# EAGLE design grbl_nano_my_clone_PR3 (EAGLE 8.1.1)
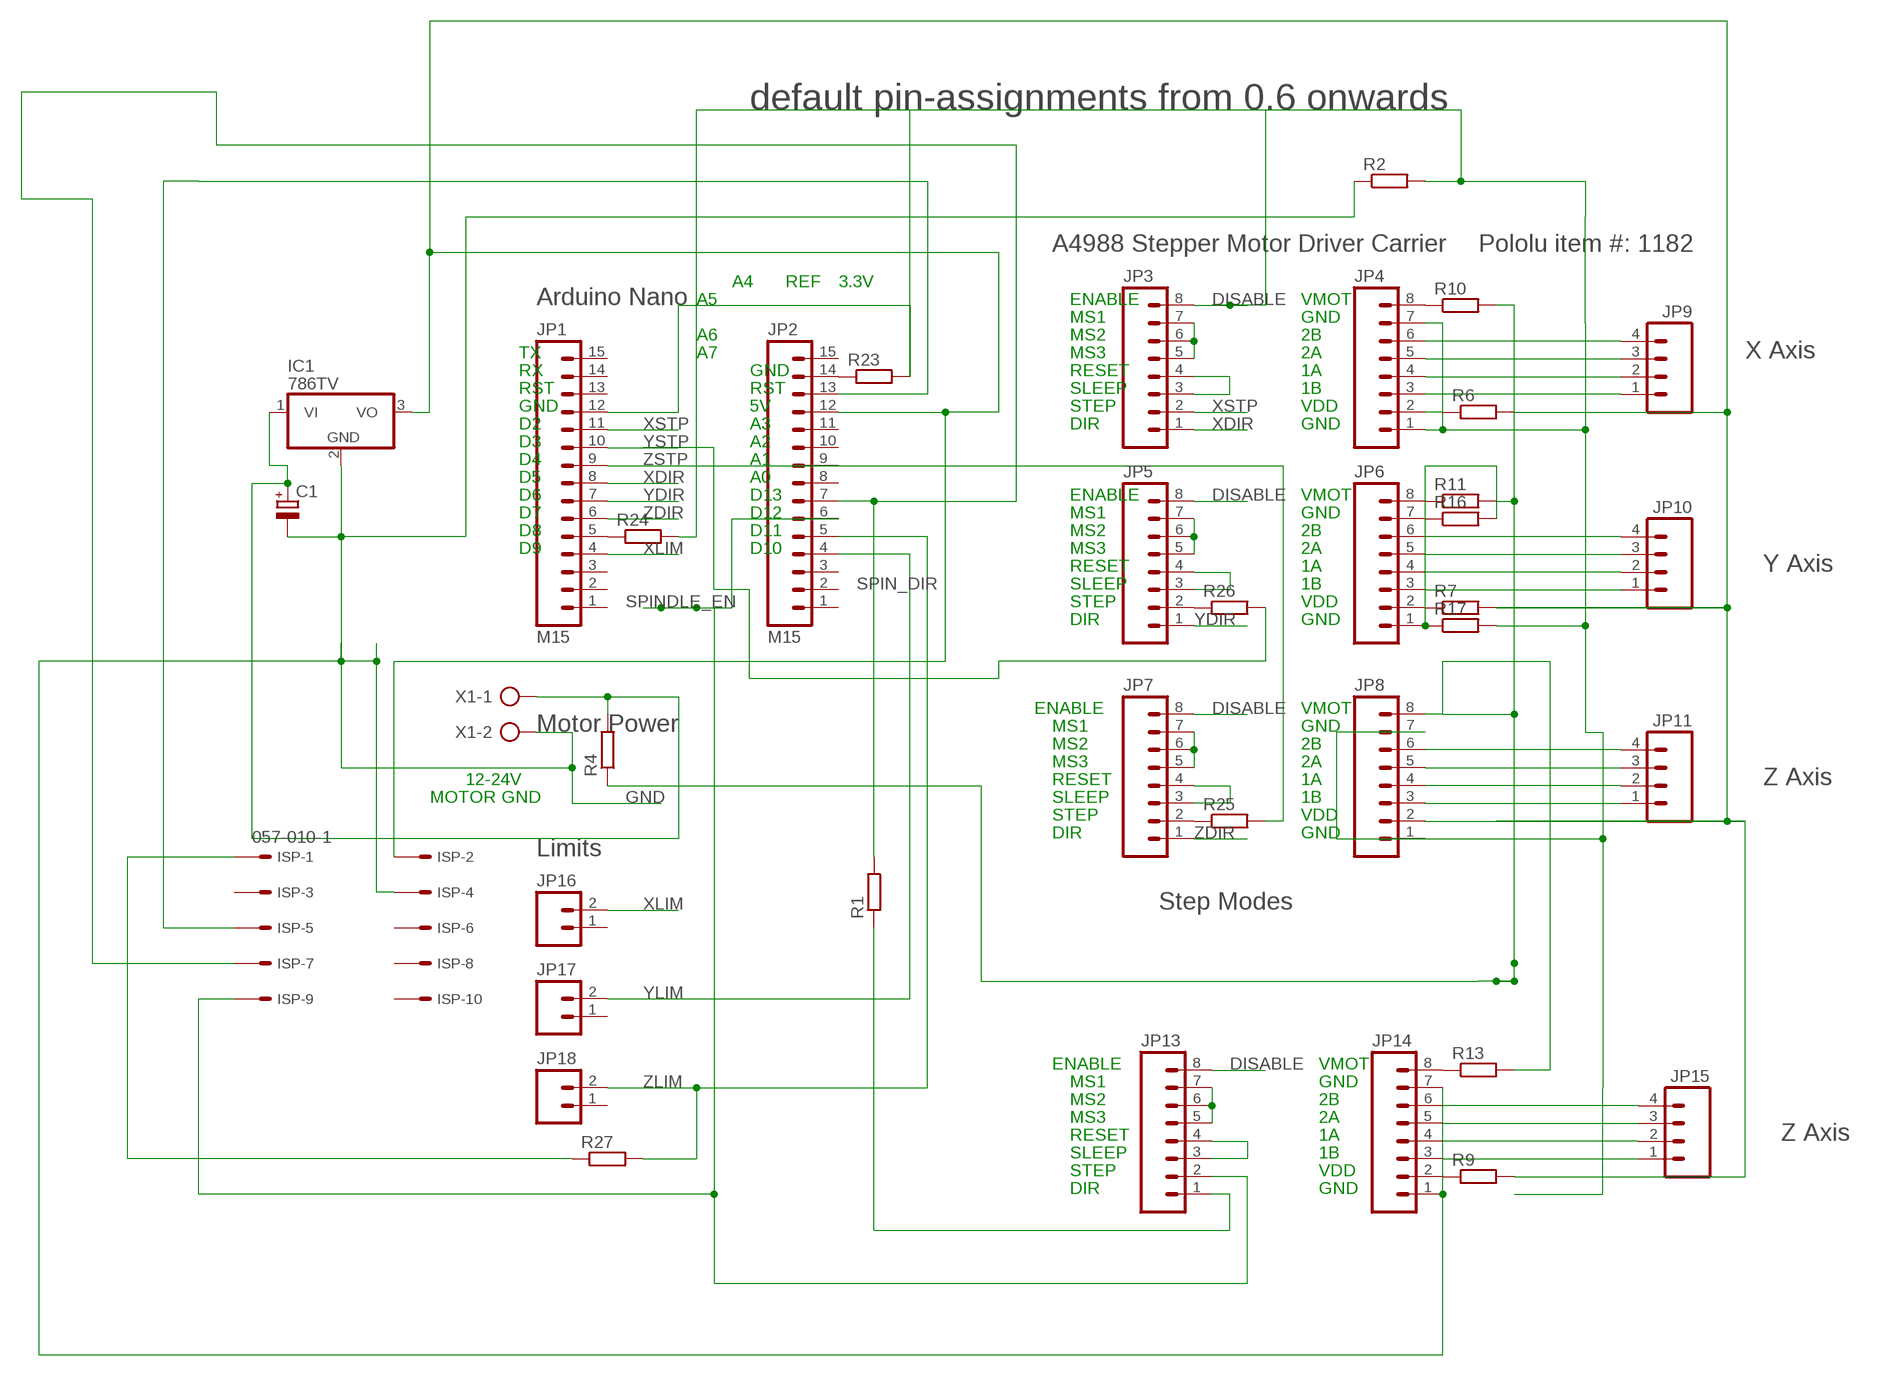
[diagram p0: schematic, sheet 1]

## Parts
C1  CPOL-EUE3.5-8  [E3,5-8]
IC1  786TV  [TO220V]
ISP  057-010-1  [057-010-1]
JP1  M15  [1X15]
JP2  M15  [1X15]
JP3  M08LONGPADS  [1X08_LONGPADS]
JP4  M08LONGPADS  [1X08_LONGPADS]
JP5  M08LONGPADS  [1X08_LONGPADS]
JP6  M08LONGPADS  [1X08_LONGPADS]
JP7  M08LONGPADS  [1X08_LONGPADS]
JP8  M08LONGPADS  [1X08_LONGPADS]
JP9  M04LONGPADS  [1X04_LONGPADS]
JP10  M04LONGPADS  [1X04_LONGPADS]
JP11  M04LONGPADS  [1X04_LONGPADS]
JP13  M08LONGPADS  [1X08_LONGPADS]
JP14  M08LONGPADS  [1X08_LONGPADS]
JP15  M04LONGPADS  [1X04_LONGPADS]
JP16  M02LOCK_LONGPADS  [1X02_LOCK_LONGPADS]
JP17  M02LOCK_LONGPADS  [1X02_LOCK_LONGPADS]
JP18  M02LOCK_LONGPADS  [1X02_LOCK_LONGPADS]
R1  R-EU_0207/15  [0207/15]
R2  R-EU_0207/15  [0207/15]
R4  R-EU_0207/12  [0207/12]
R6  R-EU_0207/15  [0207/15]
R7  R-EU_0207/15  [0207/15]
R9  R-EU_0207/15  [0207/15]
R10  R-EU_0207/7  [0207/7]
R11  R-EU_0207/7  [0207/7]
R13  R-EU_0207/15  [0207/15]
R16  R-EU_0207/12  [0207/12]
R17  R-EU_0207/12  [0207/12]
R23  R-EU_0207/15  [0207/15]
R24  R-EU_0207/15  [0207/15]
R25  R-EU_0207/15  [0207/15]
R26  R-EU_0207/15  [0207/15]
R27  R-EU_0207/15  [0207/15]
X1  AK300/2  [AK300/2]

## Nets
5V: IC1.3(VO) ISP.2 JP2.12 JP8.2 R6.2 R7.2 R9.2
DISABLE: JP3.8 JP5.8 JP7.8 JP13.8 R24.2
GND: C1.- IC1.2(GND) ISP.4 JP14.1 JP14.7 R2.1 X1.2
GNDINT: JP1.12 JP4.1 JP4.7 JP8.1 JP8.7 R2.2 R17.2 R23.2
N$1: JP5.3 JP5.4
N$2: JP4.6 JP9.4
N$3: JP4.5 JP9.3
N$4: JP4.4 JP9.2
N$5: JP4.3 JP9.1
N$6: JP8.6 JP11.4
N$7: JP8.5 JP11.3
N$8: JP8.4 JP11.2
N$9: JP8.3 JP11.1
N$10: JP6.6 JP10.4
N$11: JP6.5 JP10.3
N$12: JP6.4 JP10.2
N$13: JP6.3 JP10.1
N$14: JP7.3 JP7.4
N$15: JP3.3 JP3.4
N$16: JP14.6 JP15.4
N$17: JP14.5 JP15.3
N$18: JP14.4 JP15.2
N$19: JP14.3 JP15.1
N$20: JP13.3 JP13.4
N$21: JP13.1 R1.1
N$22: ISP.5 JP2.13
N$25: JP4.2 R6.1
N$26: C1.+ IC1.1(VI) R4.2 X1.1
N$28: JP4.8 R10.1
N$29: JP3.5 JP3.6 JP3.7
N$30: JP5.2 R26.1
N$32: JP14.2 R9.1
N$33: JP6.8 R11.1
N$35: JP14.8 R13.1
N$38: JP6.7 R16.1
N$39: JP6.1 R16.2 R17.1
N$44: JP2.14 R23.1
N$45: JP1.5 R24.1
N$46: JP7.2 R25.1
N$47: JP6.2 R7.1
N$48: JP5.5 JP5.6 JP5.7
N$49: ISP.1 R27.1
N$50: JP7.5 JP7.6 JP7.7
N$51: JP13.5 JP13.6 JP13.7
SPIN_DIR: ISP.7 JP2.7 R1.2
SPINDLE_EN: ISP.9 JP2.6 JP13.2
VMOT: JP8.8 R4.1 R10.2 R11.2 R13.2
XDIR: JP1.8 JP3.1
XLIM: JP1.4 JP16.2
XSTP: JP1.11 JP3.2
YDIR: JP1.7 JP5.1
YLIM: JP2.4 JP17.2
YSTP: JP1.10 R26.2
ZDIR: JP1.6 JP7.1
ZLIM: JP2.5 JP18.2 R27.2
ZSTP: JP1.9 R25.2
Unconnected: ISP.3 ISP.6 ISP.8 ISP.10 JP1.1 JP1.2 JP1.3 JP1.13 JP1.14 JP1.15 JP2.1 JP2.2 JP2.3 JP2.8 JP2.9 JP2.10 JP2.11 JP2.15 JP16.1 JP17.1 JP18.1

## Notes on the sheet
- default pin-assignments from 0.6 onwards
- A4988 Stepper Motor Driver Carrier | Pololu item #: 1182
- A4 | REF | 3.3V
- Arduino Nano | A5 | ENABLE | VMOT
- MS1 | GND
- A6 | MS2 | 2B
- TX | A7 | MS3 | 2A | X Axis
- RX | GND | RESET | 1A
- RST | RST | SLEEP | 1B
- GND | 5V | STEP | VDD
- D2 | A3 | DIR | GND
- D3 | A2
- D4 | A1
- D5 | A0
- D6 | D13 | ENABLE | VMOT
- D7 | D12 | MS1 | GND
- D8 | D11 | MS2 | 2B
- D9 | D10 | MS3 | 2A
- RESET | 1A | Y Axis
- SLEEP | 1B
- STEP | VDD
- DIR | GND
- ENABLE | VMOT
- Motor Power | MS1 | GND
- MS2 | 2B
- MS3 | 2A
- 12-24V | RESET | 1A | Z Axis
- MOTOR GND | SLEEP | 1B
- STEP | VDD
- DIR | GND
- Limits
- Step Modes
- ENABLE | VMOT
- MS1 | GND
- MS2 | 2B
- MS3 | 2A
- RESET | 1A | Z Axis
- SLEEP | 1B
- STEP | VDD
- DIR | GND

## Library data of the parts
C1 = rcl:CPOL-EU: POLARIZED CAPACITOR, European symbol
IC1 = linear:78*: Positive VOLTAGE REGULATOR Source: http://cache.national.com/ds/LM/LM78L05.pdf http://www.fairchildsemi.com/ds/LM/LM7805.pdf
ISP = con-panduit:057-010-: CONNECTOR 10-pin series 057 contact pc board low profile headers; OC_FARNELL: unknown; OC_NEWARK: unknown
JP1 JP2 = SparkFun:M15: Header 15 Standard 15-pin 0.1" header. Use with straight break away headers (SKU : PRT-00116), right angle break away headers (PRT-00553), swiss pins (PRT-00743), machine pins (PRT-00117), and female headers (PRT-00115).
JP3-JP8 JP13 JP14 = SparkFun:M08: Header 8 Standard 8-pin 0.1" header. Use with straight break away headers (SKU : PRT-00116), right angle break away headers (PRT-00553), swiss pins (PRT-00743), machine pins (PRT-00117), and female headers (PRT-00115).
JP9-JP11 JP15 = SparkFun:M04: Header 4 Standard 4-pin 0.1" header. Use with straight break away headers (SKU : PRT-00116), right angle break away headers (PRT-00553), swiss pins (PRT-00743), machine pins (PRT-00117), and female headers (PRT-00115). Molex polarized connector foot print use with SKU : PRT-08231 with associated crimp pins and housings. 1MM SMD Version SKU: PRT-10208
JP16-JP18 = SparkFun:M02: Header 2 Standard 2-pin 0.1" header. Use with straight break away headers (SKU : PRT-00116), right angle break away headers (PRT-00553), swiss pins (PRT-00743), machine pins (PRT-00117), and female headers (PRT-00115). Molex polarized connector foot print use with SKU : PRT-08233 with associated crimp pins and housings.
R1 R2 R4 R6 R7 R9-R11 R13 R16 R17 R23-R27 = rcl:R-EU_: RESISTOR, European symbol
X1 = con-ptr500:AK300/2: CONNECTOR; OC_FARNELL: unknown; OC_NEWARK: unknown

## Board
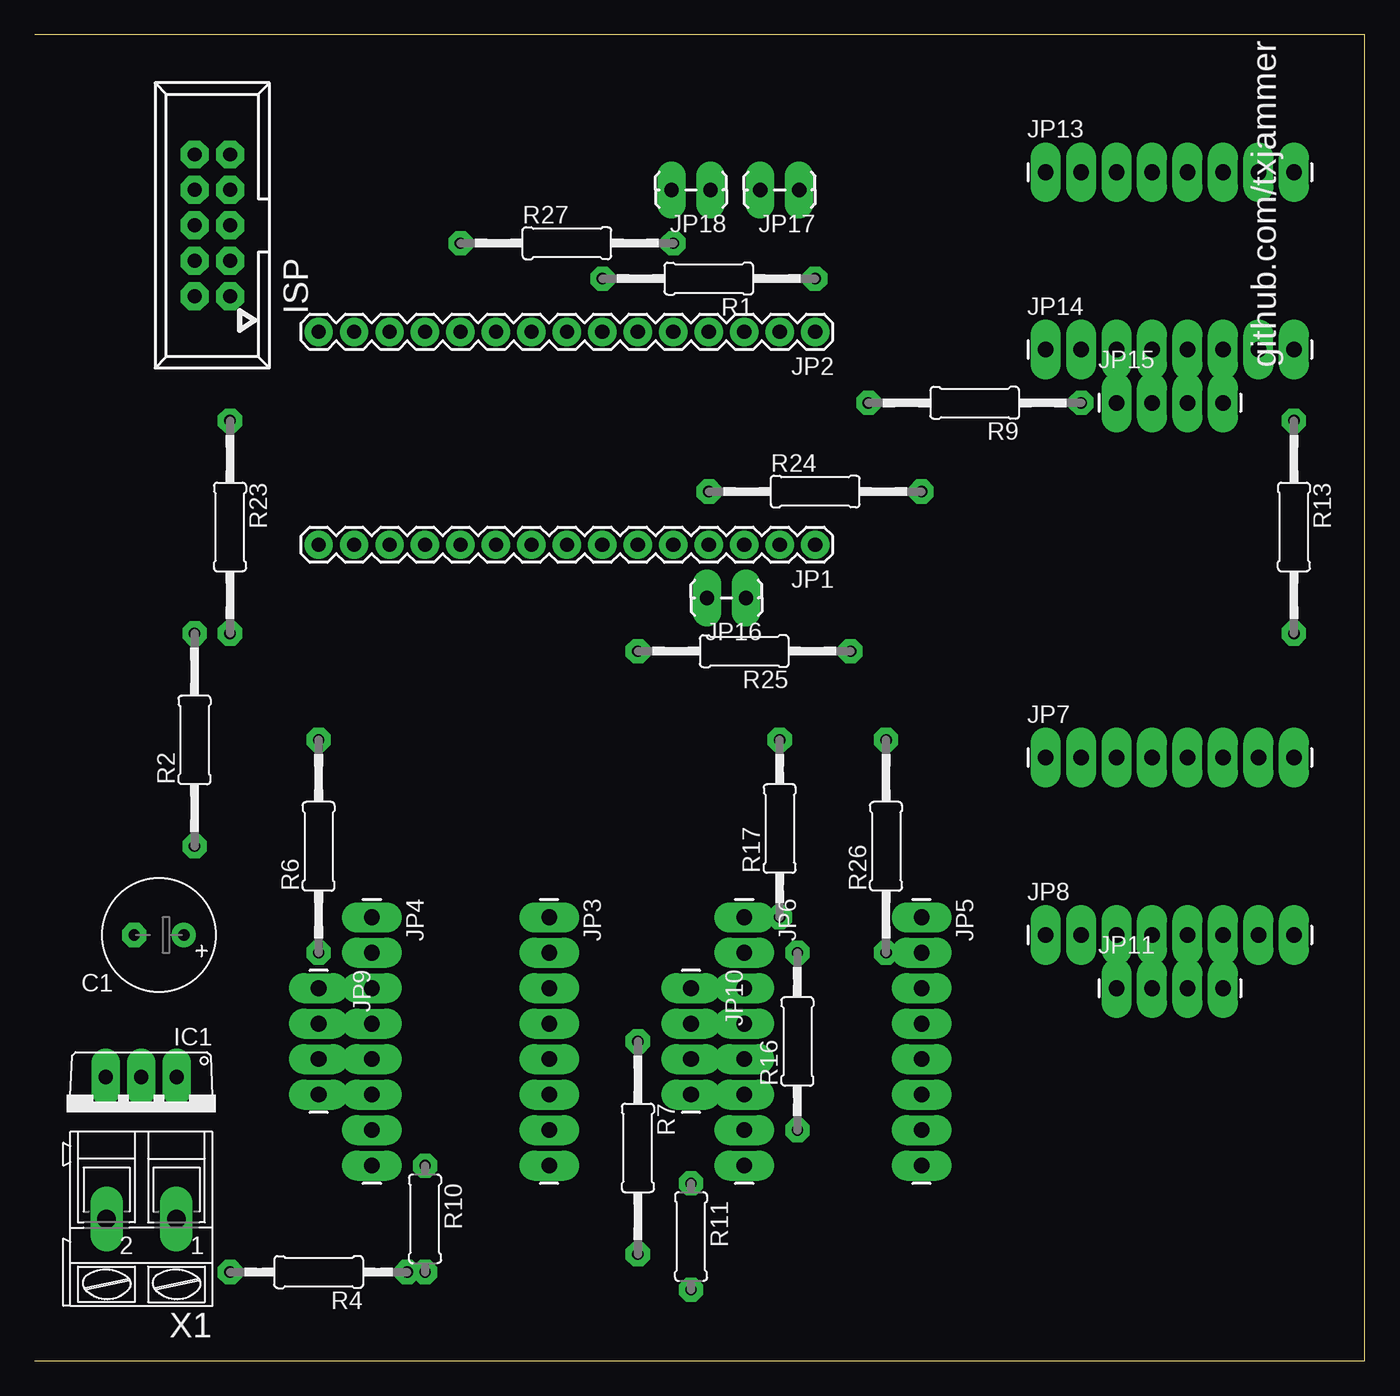
[diagram p1: board, top side]
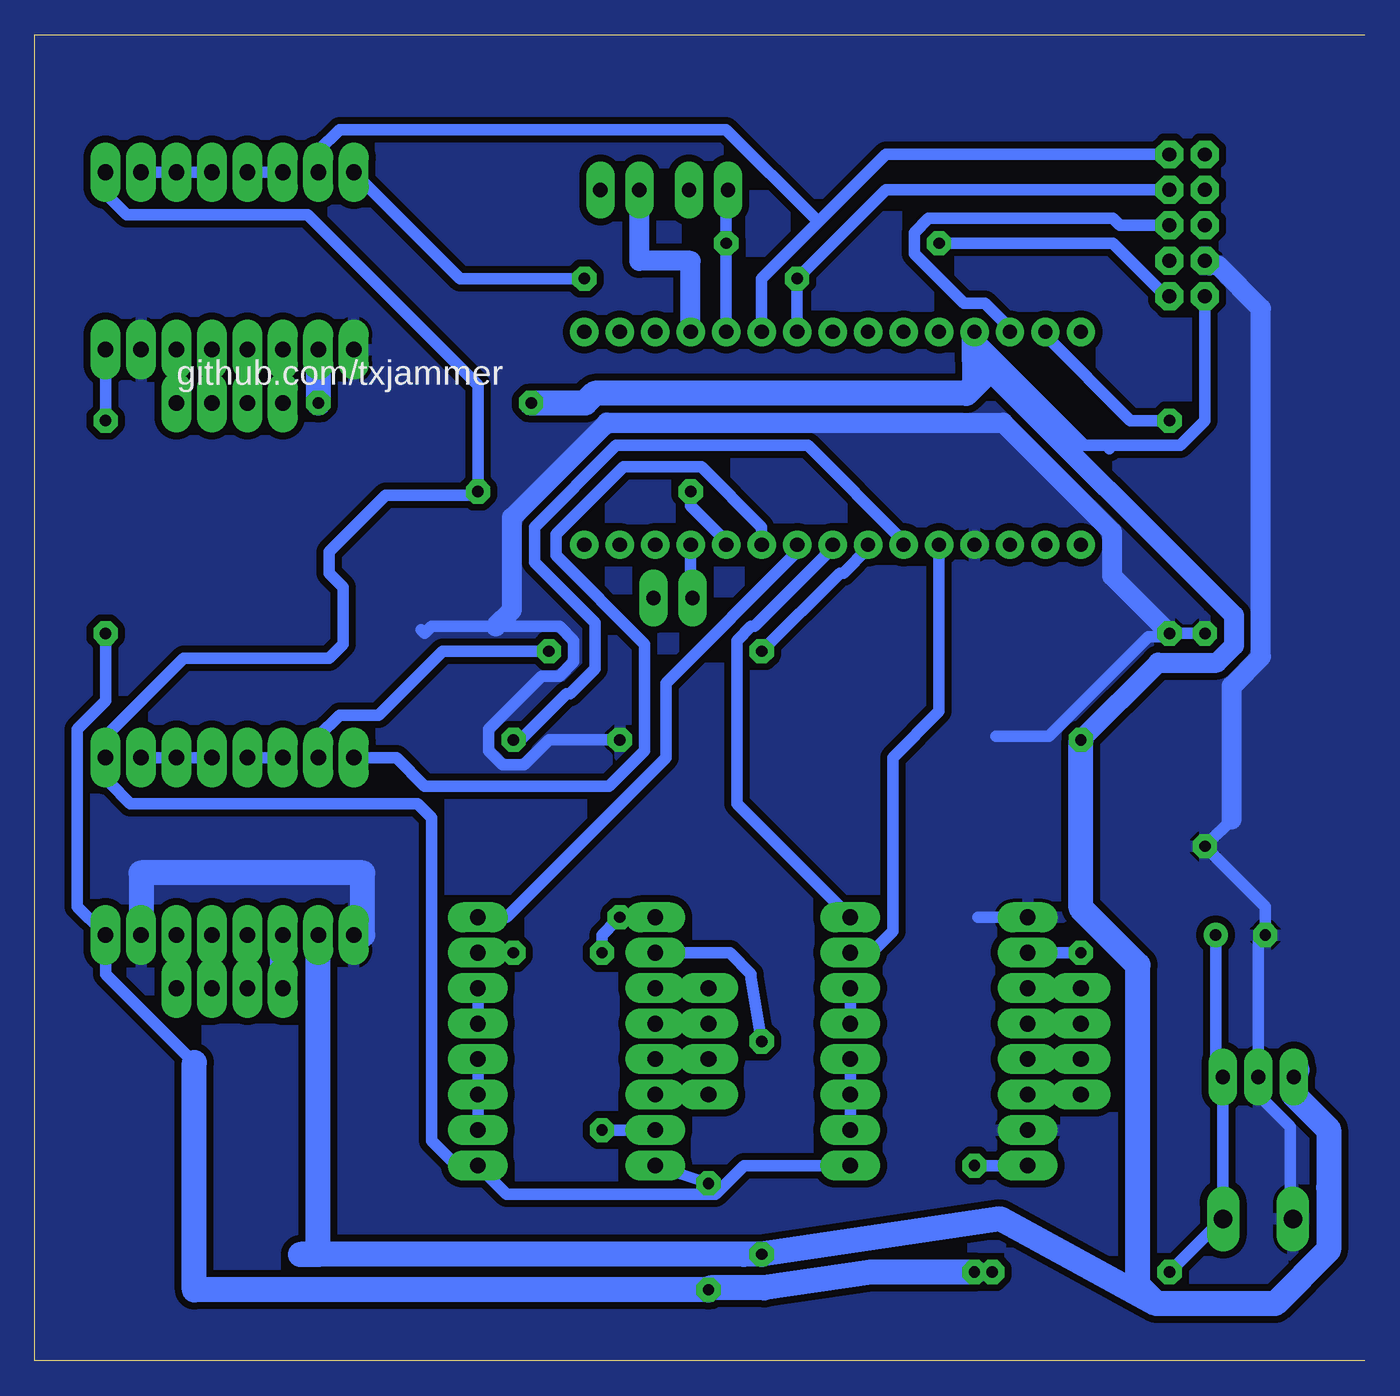
[diagram p2: board, bottom side, seen from below]

Size 95.23 x 94.92 mm. Coordinates in mm from the lower left corner, seen from the top.
Outline: 0,0 95.23,0 95.23,94.92 0,94.92
Copper layers (1*16): Top 0.035mm / dielectric 1.5mm / Bottom 0.035mm
Design rules "default *": minimum track width 32mil, minimum drill 28mil, track to track 20mil, track to pad 20mil, pad to pad 10mil, via to via 10mil, smd to smd 10mil, copper to edge 0mil, drill to drill 8mil, minimum pad ring 18mil, minimum via ring 8mil, stop-mask expansion 4mil, vias tented up to drill 0mil, thermal gap 10mil

### Footprints (pad centres in the part's own frame; a part is rotated, then mirrored left to right if it is on the bottom)
E3,5-8 = drill 0.813 pad 1.6: + -1.778,0 | drill 0.813 pad 1.6 octagon: - 1.778,0
TO220V = drill 1.016 long: 1 -2.54,-2.54; 2 0,-2.54; 3 2.54,-2.54
057-010-1 = drill 1 octagon: 1 -5.08,-1.27; 2 -5.08,1.27; 3 -2.54,-1.27; 4 -2.54,1.27; 5 0,-1.27; 6 0,1.27; 7 2.54,-1.27; 8 2.54,1.27; 9 5.08,-1.27; 10 5.08,1.27
1X15 = drill 1.016 pad 1.88: 1 0,0; 2 2.54,0; 3 5.08,0; 4 7.62,0; 5 10.16,0; 6 12.7,0; 7 15.24,0; 8 17.78,0; 9 20.32,0; 10 22.86,0; 11 25.4,0; 12 27.94,0; 13 30.48,0; 14 33.02,0; 15 35.56,0
1X08_LONGPADS = drill 1.118 pad 1.88 long: 1 0,0; 2 2.54,0; 3 5.08,0; 4 7.62,0; 5 10.16,0; 6 12.7,0; 7 15.24,0; 8 17.78,0
1X04_LONGPADS = drill 1.118 pad 1.88 long: 1 0,0; 2 2.54,0; 3 5.08,0; 4 7.62,0
1X02_LOCK_LONGPADS = drill 1.016 long: 1 -0.127,0; 2 2.667,0
0207/15 = drill 0.813 octagon: 1 -7.62,0; 2 7.62,0
0207/12 = drill 0.813 octagon: 1 -6.35,0; 2 6.35,0
0207/7 = drill 0.813 octagon: 1 -3.81,0; 2 3.81,0
AK300/2 = drill 1.321 long: 1 -2.515,0; 2 2.489,0

### Placement (x,y rotation side)
C1  8.89,30.48 180 top
IC1  7.62,17.78 180 top
ISP  12.7,81.28 90 top
JP1  55.88,58.42 180 top
JP2  55.88,73.66 180 top
JP3  36.83,31.75 270 top
JP4  24.13,31.75 270 top
JP5  63.5,31.75 270 top
JP6  50.8,31.75 270 top
JP7  72.39,43.18 0 top
JP8  72.39,30.48 0 top
JP9  20.32,26.67 270 top
JP10  46.99,26.67 270 top
JP11  77.47,26.67 0 top
JP13  72.39,85.09 0 top
JP14  72.39,72.39 0 top
JP15  77.47,68.58 0 top
JP16  50.8,54.61 180 top
JP17  54.61,83.82 180 top
JP18  48.26,83.82 180 top
R1  48.26,77.47 180 top
R2  11.43,44.45 90 top
R4  20.32,6.35 180 top
R6  20.32,36.83 90 top
R7  43.18,15.24 270 top
R9  67.31,68.58 180 top
R10  27.94,10.16 270 top
R11  46.99,8.89 270 top
R13  90.17,59.69 270 top
R16  54.61,22.86 90 top
R17  53.34,38.1 90 top
R23  13.97,59.69 270 top
R24  55.88,62.23 0 top
R25  50.8,50.8 180 top
R26  60.96,36.83 90 top
R27  38.1,80.01 0 top
X1  7.62,10.16 180 top

### Tracks (layer width: path | path; a pad name or v marks a point on that pad's centre or on a via)
5V
  Bottom 0.813: ISP.2 11.43,67.31 13.21,65.53 18.29,65.53 | 18.29,65.53 20.07,65.53 27.94,73.41 JP2.12 | 18.29,65.28 18.29,65.53 | R6.2 20.47,44.86 R6.2
  Bottom 1.422: R6.2 14.78,49.99 10.57,49.99 9.35,51.21 9.35,53.34 27.53,71.53
  Bottom 1.778: 2.56,12.39 2.56,7.93 | 2.56,16.55 2.56,12.39 | 2.56,16.55 5.08,19.06 IC1.3 5.08,20.57 4.85,20.8 | 2.56,7.93 6.41,4.09 | 6.41,4.09 14.91,4.09 | 14.91,4.09 26.06,10.16 R7.2 44.45,7.62 76.2,7.62 74.93,7.62 JP8.2 | 2.56,12.39 2.56,7.93 | 14.91,4.09 16.23,5.41 16.23,28.32 20.32,32.41 R6.2 | 2.56,16.55 2.56,12.39 | 2.56,7.93 6.41,4.09 | 6.41,4.09 14.91,4.09 | 4.85,18.83 2.56,16.55 | R9.2 55.83,68.58 55.14,69.27 28.52,69.27 27.94,69.85 | 27.94,69.85 26.67,71.12 | 27.53,71.53 27.94,71.53 JP2.12 27.94,69.85
DISABLE
  Bottom 0.813: JP3.8 44.45,13.97 46.48,11.94 61.47,11.94 JP5.8 63.75,14.22 65.28,14.22 66.8,15.75 66.8,38.86 67.82,39.88 88.39,39.88 89.92,41.4 89.92,42.93 JP7.8 90.17,44.7 84.58,50.29 74.17,50.29 73.15,51.31 73.15,55.37 74.17,56.39 74.17,57.91 70.1,61.98 63.75,61.98 R24.2 63.5,69.85 75.69,82.04 88.65,82.04 90.17,83.57 JP13.8
GND
  Bottom 0.813: ISP.4 10.92,78.23 10.67,78.23 9.4,76.96 | 9.4,38.86 9.53,38.74 11.18,37.08 R2.1 7.11,32.51 C1.- 7.37,30.23 7.62,29.97 IC1.2 7.37,20.07 7.37,18.8 5.33,16.76 5.33,10.16 X1.2 | 72.39,72.64 JP14.1
  Bottom 1.422: ISP.4 11.11,78.42 10.51,78.42 7.42,75.33 7.42,50.41 9.53,48.3 9.53,38.74
  pour Bottom (isolate 0.406): -6.35,96.52 96.52,96.52 96.52,-1.27 -6.35,-1.27
GNDINT
  Bottom 0.813: R2.2 R23.2 14.22,51.82 15.49,51.82 22.61,44.7 26.42,44.7 | R17.2 58.42,44.45 60.2,42.67 61.72,42.67 62.74,43.69 62.74,45.21 58.93,49.02 57.66,49.02 56.64,50.04 56.64,51.56 57.66,52.58 62.23,52.58 66.8,52.58 67.31,52.07 67.56,52.32 | 27.69,31.75 JP4.1 | 72.14,34.54 71.75,34.93
  Bottom 1.422: 62.23,52.58 61.06,53.75 61.06,60.36 54.27,67.16 25.9,67.16 18.09,59.35 18.09,56.19 R23.2
  Bottom 1.778: JP8.1 71.75,30.48 71.75,34.93 87.63,34.93 JP8.7
  pour Bottom (isolate 0.406): -2.54,96.52 99.06,96.52 99.06,-2.54 -2.54,-2.54
N$1
  Bottom 0.813: JP5.3 JP5.4
N$2
  Bottom 0.813: JP4.6 JP9.4
N$3
  Bottom 0.813: JP4.5 JP9.3
N$4
  Bottom 0.813: JP4.4 JP9.2
N$5
  Bottom 0.813: JP4.3 JP9.1
N$6
  Bottom 0.813: JP8.6 JP11.4
N$7
  Bottom 0.813: JP8.5 JP11.3
N$8
  Bottom 0.813: JP8.4 JP11.2
N$9
  Bottom 0.813: JP11.1 77.98,27.18 77.98,29.97 JP8.3
N$10
  Bottom 0.813: JP6.6 JP10.4
N$11
  Bottom 0.813: JP6.5 JP10.3
N$12
  Bottom 0.813: JP6.4 JP10.2
N$13
  Bottom 0.813: JP6.3 JP10.1
N$14
  Bottom 0.813: JP7.4 JP7.3
N$15
  Bottom 0.813: JP3.3 JP3.4
N$16
  Bottom 0.813: JP14.6 JP15.4
N$17
  Bottom 0.813: JP14.5 JP15.3
N$18
  Bottom 0.813: JP14.4 JP15.2
N$19
  Bottom 0.813: JP14.3 JP15.1
N$20
  Bottom 0.813: JP13.4 JP13.3
N$21
  Bottom 0.813: R1.1 64.77,77.47 JP13.1
N$22
  Bottom 0.813: ISP.5 17.53,81.28 18.03,81.79 31.24,81.79 32.26,80.77 32.26,79.25 28.7,75.69 27.18,75.69 25.4,73.91 JP2.13
N$23
  pour Bottom (isolate 0.406): -7.62,96.52 97.79,96.52 97.79,-2.54 -7.62,-2.54
N$25
  Bottom 0.813: JP4.2 R6.1
N$26
  Bottom 0.813: R4.2 10.16,10.16 X1.1 10.16,10.41 10.16,20.07 IC1.1 10.67,20.83 C1.+
N$28
  Bottom 0.813: JP4.8 R10.1
N$29
  Bottom 0.813: JP3.7 JP3.6 36.83,19.3 JP3.5
N$30
  Bottom 0.813: JP5.2 R26.1
N$32
  Bottom 1.778: JP14.2 R9.1
N$33
  Bottom 0.813: JP6.8 R11.1
N$35
  Bottom 0.813: JP14.8 R13.1
N$38
  Bottom 0.813: JP6.7 R16.1
N$39
  Bottom 0.813: JP6.1 R17.1 53.59,31.5 54.61,30.48 R16.2
N$44
  Bottom 0.813: R23.1 16.76,67.31 22.86,73.41 JP2.14
N$45
  Bottom 0.813: R24.1 48.26,61.21 45.72,58.67 JP1.5
N$46
  Bottom 0.813: R25.1 66.04,50.8 70.61,46.23 73.41,46.23 74.93,44.7 JP7.2
N$47
  Bottom 0.813: R7.1 43.94,27.43 43.94,27.69 45.47,29.21 JP6.2
N$48
  Bottom 0.813: JP5.7 JP5.6 63.5,19.3 JP5.5
N$49
  Bottom 0.813: R27.1 18.03,80.01 14.22,76.2 ISP.1
N$50
  Bottom 0.813: JP7.5 JP7.6 85.34,43.18 JP7.7
N$51
  Bottom 0.813: JP13.5 JP13.6 85.34,85.09 JP13.7
SPIN_DIR
  Bottom 0.813: JP2.7 R1.2 40.39,77.72 34.29,83.82 ISP.7
SPINDLE_EN
  Bottom 0.813: ISP.9 34.29,86.36 39.12,81.53 | 39.12,81.53 43.18,77.47 JP2.6 | JP13.2 74.93,86.61 73.41,88.14 45.72,88.14 39.37,81.79 39.12,81.53
VMOT
  Bottom 0.813: R4.1 R10.2 | 83.82,21.34 90.17,27.69 JP8.8 90.42,30.73 92.2,32.51 92.2,45.21 90.17,47.24 R13.2
  Bottom 1.778: 83.82,21.34 83.82,5.08 R11.2 46.85,5.22 43,5.22 35.38,6.35 R10.2
XDIR
  Bottom 0.813: JP1.8 38.61,57.91 38.61,57.66 43.69,52.58 43.94,52.58 44.96,51.56 44.96,39.88 JP3.1
XLIM
  Bottom 0.813: JP1.4 48.26,54.61 JP16.2
XSTP
  Bottom 0.813: JP1.11 30.48,46.48 33.78,43.18 33.78,30.73 35.31,29.21 JP3.2
YDIR
  Bottom 0.813: JP1.7 40.64,57.91 50.04,48.51 50.04,43.18 61.47,31.75 JP5.1
YLIM
  Bottom 1.422: JP2.4 48.26,78.74 51.94,78.74 JP17.2
YSTP
  Bottom 0.813: R26.2 60.45,44.45 57.15,47.75 56.9,47.75 55.12,49.53 55.12,52.83 59.44,57.15 59.44,59.69 53.59,65.53 39.88,65.53 33.02,58.67 JP1.10
ZDIR
  Bottom 0.813: JP1.6 43.18,59.69 47.5,64.01 53.09,64.01 57.91,59.18 57.91,57.66 51.56,51.31 51.56,43.69 54.1,41.15 67.31,41.15 69.34,43.18 JP7.1
ZLIM
  Bottom 0.813: JP18.2 45.72,83.82 R27.2 45.72,79.76 JP2.5
ZSTP
  Bottom 0.813: R25.2 37.59,56.39 37.34,56.39 35.56,58.17 JP1.9

### Text on the board
tNames: github.com/txjammer
bNames: github.com/txjammer